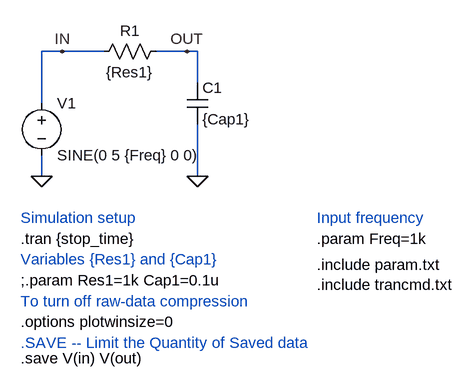
[diagram p0: schematic LPF_20201115.asc]
LPF_20201115.asc, the LTspice schematic file:
Version 4
SHEET 1 880 680
WIRE 80 16 48 16
WIRE 144 16 80 16
WIRE 272 16 224 16
WIRE 288 16 272 16
WIRE 288 64 288 16
WIRE 48 96 48 16
WIRE 48 208 48 176
WIRE 288 208 288 128
FLAG 48 208 0
FLAG 80 16 IN
FLAG 288 208 0
FLAG 272 16 OUT
SYMBOL voltage 48 80 R0
WINDOW 123 0 0 Left 0
WINDOW 39 0 0 Left 0
SYMATTR InstName V1
SYMATTR Value SINE(0 5 {Freq} 0 0)
SYMBOL res 240 0 R90
WINDOW 0 0 56 VBottom 2
WINDOW 3 32 56 VTop 2
SYMATTR InstName R1
SYMATTR Value {Res1}
SYMBOL cap 272 64 R0
SYMATTR InstName C1
SYMATTR Value {Cap1}
TEXT 16 304 Left 2 !.tran {stop_time}
TEXT 16 272 Left 2 ;Simulation setup
TEXT 16 336 Left 2 ;Variables {Res1} and {Cap1}
TEXT 16 368 Left 2 !;.param Res1=1k Cap1=0.1u
TEXT 16 400 Left 2 ;To turn off raw-data compression
TEXT 16 432 Left 2 !.options plotwinsize=0
TEXT 16 464 Left 2 ;.SAVE -- Limit the Quantity of Saved data
TEXT 16 488 Left 2 !.save V(in) V(out)
TEXT 472 272 Left 2 ;Input frequency
TEXT 472 304 Left 2 !.param Freq=1k
TEXT 472 344 Left 2 !.include param.txt\n.include trancmd.txt

The netlist it stands for:
* LPF_20201115.asc
V1 IN 0 SINE(0 5 {Freq} 0 0)
R1 OUT IN {Res1}
C1 OUT 0 {Cap1}
.tran {stop_time}
* Simulation setup
* Variables {Res1} and {Cap1}
;.param Res1=1k Cap1=0.1u
* To turn off raw-data compression
.options plotwinsize=0
* .SAVE -- Limit the Quantity of Saved data
.save V(in) V(out)
* Input frequency
.param Freq=1k
.include param.txt
.include trancmd.txt
.backanno
.end